# Altium schematic sheet WiFi&BT.SchDoc
size A4
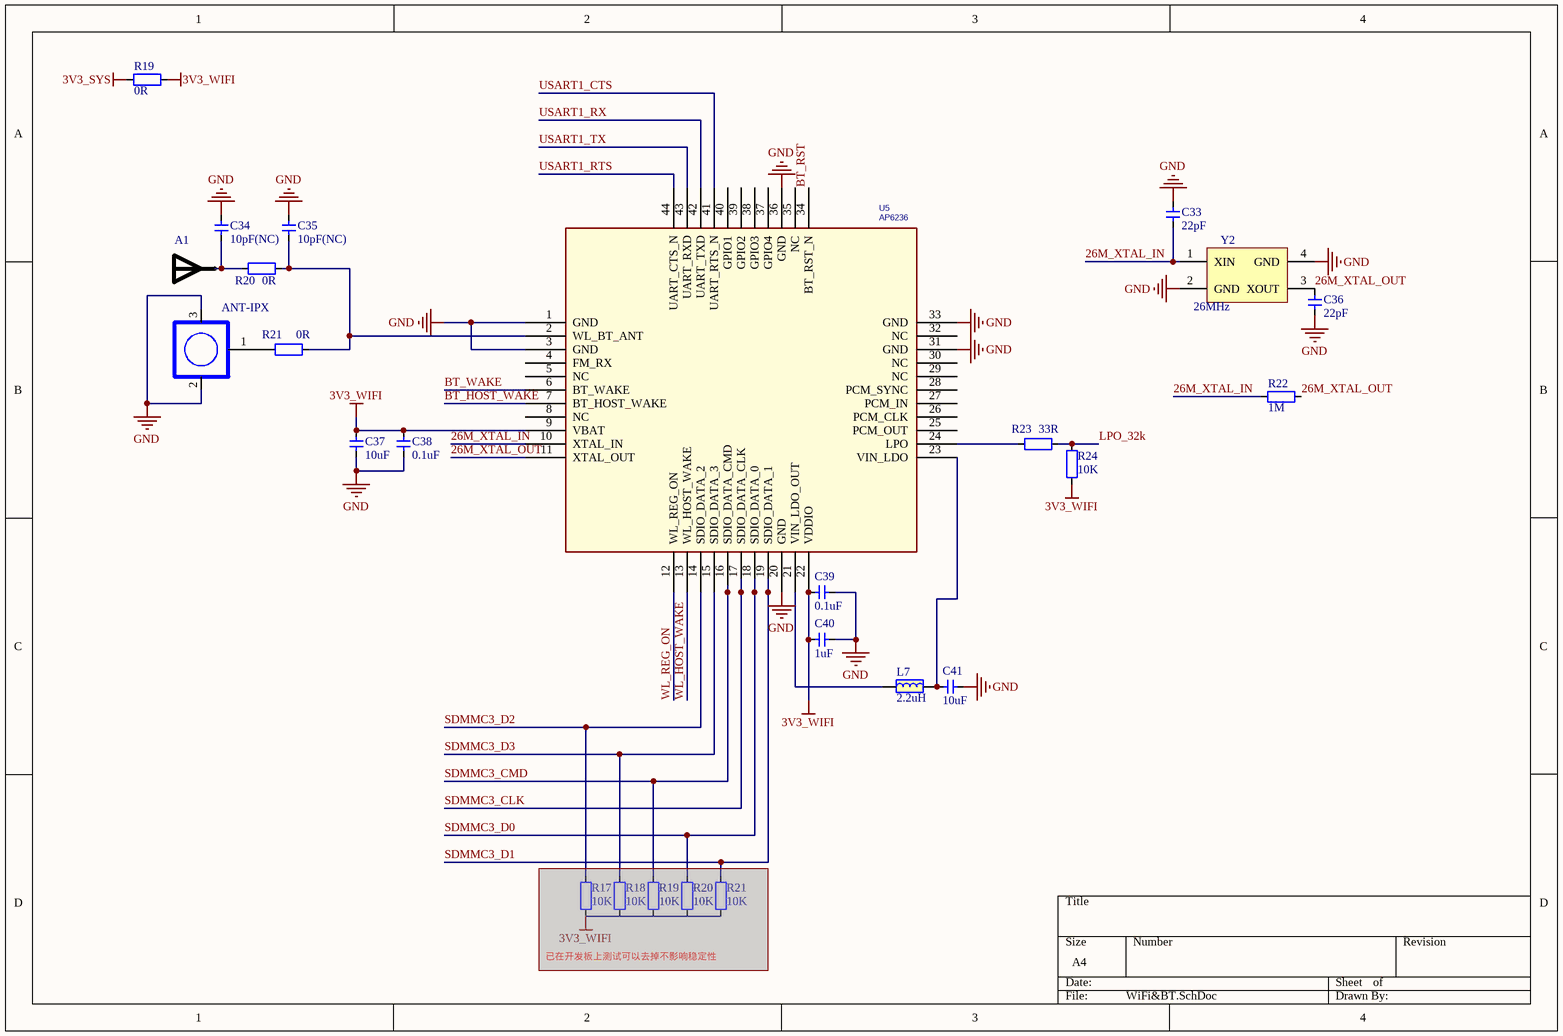
[diagram p0: WiFi&BT.SchDoc]

## Parts
(Parts that share a designator on the sheet are numbered #1, #2 ... from top to bottom, then left to right.)
*1  ANT-IPX  [IPX-ANTENNA]
A1  RAINSUN  [ANT-Rainsun-AN5120]  (value not drawn)
C33  22pF  [CAP_0402]
C34  10pF(NC)  [CAP_0402]
C35  10pF(NC)  [CAP_0402]
C36  22pF  [CAP_0402]
C37  10uF  [CAP_0402]
C38  0.1uF  [CAP_0402]
C39  0.1uF  [CAP_0402]
C40  1uF  [CAP_0402]
C41  10uF  [CAP_0402]
L7  2.2uH  [IND-201612]
R17  10K  [RES_0402]  (masked out: inside a compile mask, not in the netlist)
R18  10K  [RES_0402]  (masked out: inside a compile mask, not in the netlist)
R19#1  0R  [RES_0402]
R19#2  10K  [RES_0402]  (masked out: inside a compile mask, not in the netlist)
R20#1  0R  [RES_0402]
R20#2  10K  [RES_0402]  (masked out: inside a compile mask, not in the netlist)
R21#1  0R  [RES_0402]
R21#2  10K  [RES_0402]  (masked out: inside a compile mask, not in the netlist)
R22  1M  [RES_0402]
R23  33R  [RES_0402]
R24  10K  [RES_0402]
U5  AP6236  [AP6236]
Y2  26MHz  [晶振2520]

## Nets
3V3_SYS: R19#1.1
3V3_WIFI: C37.2 C38.2 C39.2 C40.2 R19#1.2 R24.2 U5.9(VBAT) U5.22(VDDIO)
GND: *1.2(GND) *1.3(GND) C33.2 C34.2 C35.2 C36.1 C37.1 C38.1 C39.1 C40.1 C41.1 U5.1(GND) U5.3(GND) U5.20(GND) U5.31(GND) U5.33(GND) U5.36(GND) Y2.2(GND) Y2.4(GND)
26M_XTAL_IN: C33.1 R22.1 U5.10(XTAL_IN) Y2.1(XIN)
26M_XTAL_OUT: C36.2 R22.2 U5.11(XTAL_OUT) Y2.3(XOUT)
BT_HOST_WAKE: U5.7(BT_HOST_WAKE)
BT_RST: U5.34(BT_RST_N)
BT_WAKE: U5.6(BT_WAKE)
LPO_32k: R23.1 R24.1
SDMMC3_CLK: U5.17(SDIO_DATA_CLK)
SDMMC3_CMD: U5.16(SDIO_DATA_CMD)
SDMMC3_D0: U5.18(SDIO_DATA_0)
SDMMC3_D1: U5.19(SDIO_DATA_1)
SDMMC3_D2: U5.14(SDIO_DATA_2)
SDMMC3_D3: U5.15(SDIO_DATA_3)
USART1_CTS: U5.41(UART_RTS_N)
USART1_RTS: U5.44(UART_CTS_N)
USART1_RX: U5.42(UART_TXD)
USART1_TX: U5.43(UART_RXD)
WL_HOST_WAKE: U5.13(WL_HOST_WAKE)
WL_REG_ON: U5.12(WL_REG_ON)
Net*1_1: *1.1(ANT) R21#1.2
NetA1_1: A1.1 C34.1 R20#1.2
NetC35_1: C35.1 R20#1.1 R21#1.1 U5.2(WL_BT_ANT)
NetC41_2: C41.2 L7.2 U5.23(VIN_LDO)
NetL7_1: L7.1 U5.21(VIN_LDO_OUT)
NetR23_2: R23.2 U5.24(LPO)

Not connected (* = marked no-connect by the designer): U5 4(FM_RX) 5(NC) 8(NC) 25(PCM_OUT) 26(PCM_CLK) 27(PCM_IN) 28(PCM_SYNC) 29(NC) 30(NC) 32(NC) 35(NC) 37(GPIO4) 38(GPIO3) 39(GPIO2) 40(GPIO1)

## Notes on the sheet
- 已在开发板上测试可以去掉不影响稳定性

## Library data of the parts
A1 = ANT-Rainsun-AP5120
C33-C41 = 电容-0402: Capacitor; Value: 0.1u
L7 = 电感-201612
R17 R18 R19#1 R19#2 R20#1 R20#2 R21#1 R21#2 R22-R24 = 电阻-0402: Resistor; Value: 22R
U5 = AP6236: ORCAD_LIB: MODULE; QVL: AMPAK; Device: APSERIES
Y2 = 晶振-4Pin-无源: 2520无源; MF: ECS International; MP: ECS-3225S30-240-EN-TR; Package: SMD-6 ECS International; Price: 0.75 USD; Availability: Unavailable; Value: *